# Altium schematic sheet BMS_TopLevel.SchDoc: TopLevel schematic
size A3; SheetNumber: 1; SheetTotal: 7
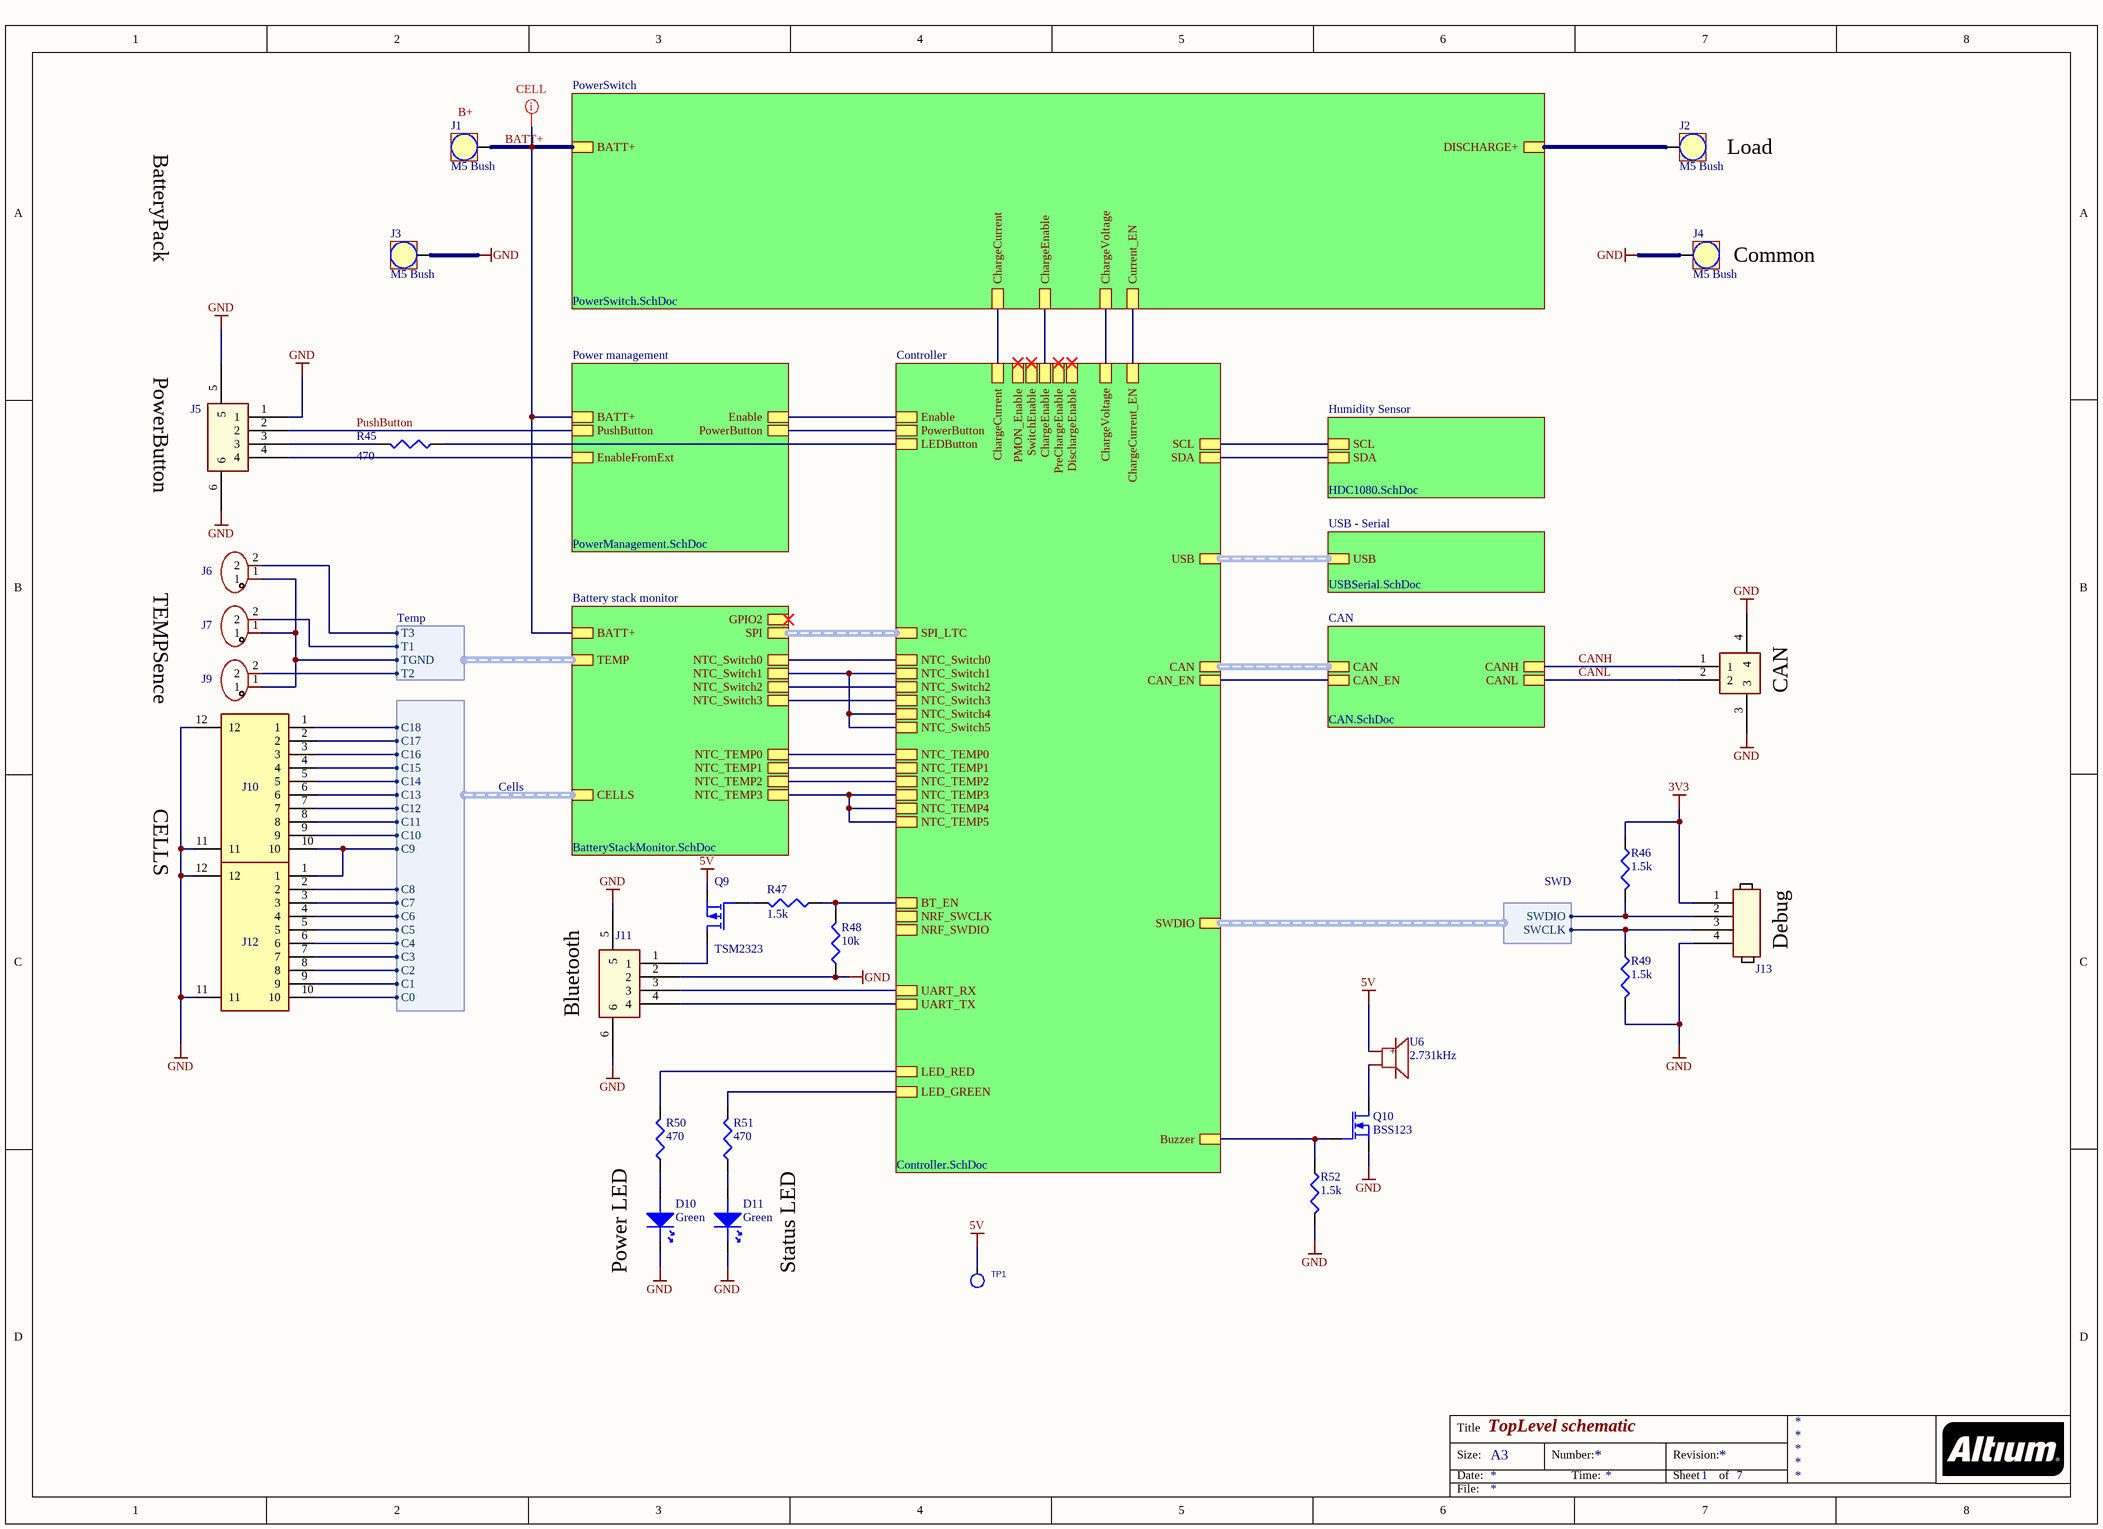
[diagram p0: BMS_TopLevel.SchDoc]

## Parts
D10  Green  [LED0603]
D11  Green  [LED0603]
J1  M5 Bush  [CONN-TH_T44001]
J2  M5 Bush  [CONN-TH_T44001]
J3  M5 Bush  [CONN-TH_T44001]
J4  M5 Bush  [CONN-TH_T44001]
J5  1.25-4PWTDK  [SM04B-GHS-TB]  (value not drawn)
J6  WAFER-XH254Z-2A  [CONN-TH_2P-P2.50_XH-2AW]  (value not drawn)
J7  WAFER-XH254Z-2A  [CONN-TH_2P-P2.50_XH-2AW]  (value not drawn)
J8  1.25-2PWTDK  [BM02B-GHS-TBT_1]  (value not drawn)
J9  WAFER-XH254Z-2A  [CONN-TH_2P-P2.50_XH-2AW]  (value not drawn)
J10  S10B-PH-SM4-TB_LF__SN_  [S10B-PH-SM4-TB]  (value not drawn)
J11  1.25-4PWTDK  [SM04B-GHS-TB]  (value not drawn)
J12  S10B-PH-SM4-TB_LF__SN_  [S10B-PH-SM4-TB]  (value not drawn)
J13  4 HEADER  [PZ-4P-2_54]  (value not drawn)
Q9  TSM2323  [SOT-23]
Q10  BSS123  [SOT-23]
R45  470  [0402]
R46  1.5k  [0402]
R47  1.5k  [0402]
R48  10k  [0402]
R49  1.5k  [0402]
R50  470  [0402]
R51  470  [0402]
R52  1.5k  [0402]
TP1  1.3TP  [TP2-1.3MM]  (value not drawn)  (no BOM)
U6  2.731kHz  [BUZ-SMD_4P-L7.5-W7.5-BR]

## Sub-sheets
Battery stack monitor = BatteryStackMonitor.SchDoc: SPI (harness SPI), CELLS (harness Cells), TEMP (harness Temp), BATT+, NTC_Switch0, NTC_Switch1, NTC_Switch2, NTC_Switch3, NTC_TEMP2, NTC_TEMP3, NTC_TEMP0, NTC_TEMP1, GPIO2
CAN = CAN.SchDoc: CANH, CAN (harness CAN), CANL, CAN_EN
Controller = Controller.SchDoc: SPI_LTC (harness SPI), DischargeEnable, ChargeEnable, SwitchEnable, PreChargeEnable, CAN (harness CAN), SWDIO (harness SWD), Buzzer, PMON_Enable, CAN_EN, ChargeCurrent, ChargeVoltage, NTC_Switch0, NTC_Switch1, NTC_Switch2, NTC_Switch3, NTC_Switch4, NTC_Switch5, NTC_TEMP0, NTC_TEMP1, NTC_TEMP2, NTC_TEMP3, NTC_TEMP4, NTC_TEMP5, ChargeCurrent_EN, USB (harness USB), LED_RED, LED_GREEN, UART_TX, UART_RX, NRF_SWCLK, NRF_SWDIO, Enable, PowerButton, LEDButton, SCL, SDA, BT_EN
Humidity Sensor = HDC1080.SchDoc: SCL, SDA
Power management = PowerManagement.SchDoc: PushButton, BATT+, Enable, PowerButton, EnableFromExt
PowerSwitch = PowerSwitch.SchDoc: ChargeEnable, DISCHARGE+, BATT+, ChargeCurrent, ChargeVoltage, Current_EN
USB - Serial = USBSerial.SchDoc: USB (harness USB)

## Harnesses
Cells: C1, C9, C2, C3, C4, C5, C6, C7, C8, C10, C11, C0, C12, C13, C14, C15, C16, C17, C18
Temp: T1, T2, TGND, T3
SWD: SWCLK, SWDIO

## Nets
3V3: J13.1 R46.1
5V: Q9.S TP1.1(TP) U6.1(+)
GND: D10.1 D11.1 J3.1 J4.1 J5.1 J5.5 J5.6 J8.3 J8.4 J10.11 J10.12 J11.2 J11.5 J11.6 J12.11 J12.12 J13.4 Q10.S R48.1 R49.2 R52.2
BATT+: J1.1 ; sheet Battery stack monitor/BATT+, sheet PowerSwitch/BATT+, sheet Power management/BATT+
CANH: J8.1 ; sheet CAN/CANH
CANL: J8.2 ; sheet CAN/CANL
PushButton: J5.2 ; sheet Power management/PushButton
NetD10_2: D10.2 R50.1
NetD11_2: D11.2 R51.1
NetJ2_1: J2.1 ; sheet PowerSwitch/DISCHARGE+
NetJ5_3: J5.3 R45.2
NetJ5_4: J5.4 ; sheet Power management/EnableFromExt
NetJ6_1: J6.1 J7.1 J9.1 ; sheet Battery stack monitor/TEMP.TGND
NetJ6_2: J6.2 ; sheet Battery stack monitor/TEMP.T3
NetJ7_2: J7.2 ; sheet Battery stack monitor/TEMP.T1
NetJ9_2: J9.2 ; sheet Battery stack monitor/TEMP.T2
NetJ10_1: J10.1 ; sheet Battery stack monitor/CELLS.C18
NetJ10_2: J10.2 ; sheet Battery stack monitor/CELLS.C17
NetJ10_3: J10.3 ; sheet Battery stack monitor/CELLS.C16
NetJ10_4: J10.4 ; sheet Battery stack monitor/CELLS.C15
NetJ10_5: J10.5 ; sheet Battery stack monitor/CELLS.C14
NetJ10_6: J10.6 ; sheet Battery stack monitor/CELLS.C13
NetJ10_7: J10.7 ; sheet Battery stack monitor/CELLS.C12
NetJ10_8: J10.8 ; sheet Battery stack monitor/CELLS.C11
NetJ10_9: J10.9 ; sheet Battery stack monitor/CELLS.C10
NetJ10_10: J10.10 J12.1 ; sheet Battery stack monitor/CELLS.C9
NetJ11_1: J11.1 Q9.D
NetJ11_3: J11.3 ; sheet Controller/UART_RX
NetJ11_4: J11.4 ; sheet Controller/UART_TX
NetJ12_2: J12.2 ; sheet Battery stack monitor/CELLS.C8
NetJ12_3: J12.3 ; sheet Battery stack monitor/CELLS.C7
NetJ12_4: J12.4 ; sheet Battery stack monitor/CELLS.C6
NetJ12_5: J12.5 ; sheet Battery stack monitor/CELLS.C5
NetJ12_6: J12.6 ; sheet Battery stack monitor/CELLS.C4
NetJ12_7: J12.7 ; sheet Battery stack monitor/CELLS.C3
NetJ12_8: J12.8 ; sheet Battery stack monitor/CELLS.C2
NetJ12_9: J12.9 ; sheet Battery stack monitor/CELLS.C1
NetJ12_10: J12.10 ; sheet Battery stack monitor/CELLS.C0
NetJ13_2: J13.2 R46.2 ; sheet Controller/SWDIO.SWDIO
NetJ13_3: J13.3 R49.1 ; sheet Controller/SWDIO.SWCLK
NetQ9_G: Q9.G R47.2
NetQ10_D: Q10.D U6.2
NetQ10_G: Q10.G R52.1 ; sheet Controller/Buzzer
NetR45_1: R45.1 ; sheet Controller/LEDButton
NetR47_1: R47.1 R48.2 ; sheet Controller/BT_EN
NetR50_2: R50.2 ; sheet Controller/LED_RED
NetR51_2: R51.2 ; sheet Controller/LED_GREEN
(unnamed): sheet Battery stack monitor/NTC_Switch0, sheet Controller/NTC_Switch0
(unnamed): sheet Battery stack monitor/NTC_Switch1, sheet Controller/NTC_Switch1, sheet Controller/NTC_Switch4, sheet Controller/NTC_Switch5
(unnamed): sheet Battery stack monitor/NTC_Switch2, sheet Controller/NTC_Switch2
(unnamed): sheet Battery stack monitor/NTC_Switch3, sheet Controller/NTC_Switch3
(unnamed): sheet Battery stack monitor/NTC_TEMP2, sheet Controller/NTC_TEMP2
(unnamed): sheet Battery stack monitor/NTC_TEMP3, sheet Controller/NTC_TEMP3, sheet Controller/NTC_TEMP4, sheet Controller/NTC_TEMP5
(unnamed): sheet Battery stack monitor/NTC_TEMP0, sheet Controller/NTC_TEMP0
(unnamed): sheet Battery stack monitor/NTC_TEMP1, sheet Controller/NTC_TEMP1
(unnamed): sheet Controller/ChargeEnable, sheet PowerSwitch/ChargeEnable
(unnamed): sheet Controller/CAN_EN, sheet CAN/CAN_EN
(unnamed): sheet Controller/ChargeCurrent, sheet PowerSwitch/ChargeCurrent
(unnamed): sheet Controller/ChargeVoltage, sheet PowerSwitch/ChargeVoltage
(unnamed): sheet Controller/ChargeCurrent_EN, sheet PowerSwitch/Current_EN
(unnamed): sheet Controller/Enable, sheet Power management/Enable
(unnamed): sheet Controller/PowerButton, sheet Power management/PowerButton
(unnamed): sheet Controller/SCL, sheet Humidity Sensor/SCL
(unnamed): sheet Controller/SDA, sheet Humidity Sensor/SDA

Not connected (* = marked no-connect by the designer): U6 3 4

## Buses and harness runs
harness sheet Battery stack monitor/SPI = sheet Controller/SPI_LTC
harness sheet CAN/CAN = sheet Controller/CAN
harness sheet Controller/USB = sheet USB - Serial/USB

## Layout directives
net class CELL: BATT+

## Notes on the sheet
- BatteryPack
- (near J2) Load
- (near J4) Common
- (near J5) PowerButton
- TEMPSence
- (near J8) CAN
- CELLS
- (near J11) Bluetooth
- (near J13) Debug
- Power LED
- Status LED
- Labels drawn without touching a wire or pin: B+
- Title
- Size:
- Date:
- A3
- Number:
- Time:
- Revision:
- Sheet
- of
- File:

## Library data of the parts
D10 D11 = KP-2012SGC: Led, Green, Li:12mcd, Vf:2.2V, If:0.02A; Brand: KingBright; Case Style: 0805; Forward Current: 0.02A; Forward Voltage: 2.2V; Luminous Intensity: 12mcd; Brand Number: KP-2012SGC; Order Code Supplier: 1318243; Price: 0,06; Supplier: Farnell; Temperature Range: -30°C to +85°C
J1-J4 = T44001: Bush with Circumference M4; Brand: Wurth; Brand Number: 7460408; Case Style: M5Bush; Order Code Supplier: 1821279; Price: 4,17; Supplier: Farnell
J6 J7 J9 = WAFER-XH254Z-2A: Manufacturer: HANBO(汉博); Add into BOM: yes; Pins Structure: 1x2P; Pitch: 2.54mm; Reference Series: XH; Number of PINs Per Row: 2; Current Rating (Max): 3A; Symbol: WAFER-XH254Z-2A; Device: WAFER-XH254Z-2A; LCSC Part Name: WAFER-XH254Z-2A; Supplier Part: C7432682; Manufacturer Part: WAFER-XH254Z-2A; Supplier Footprint: 插件,P=2.5mm; Datasheet: https://atta.szlcsc.com/upload/public/pdf/source/20230718/3B4FABA5D38EFB02DAF74E7C2B33D98F.pdf; Supplier: LCSC; Convert to PCB: yes; Mounting Style: 直插; Number of Pins: 2P; Number of Rows: 1; Operating Temperature Range: -25℃~+85℃
J10 J12 = S10B-PH-SM4-TB_LF__SN_: Connector; Manufacturer_Name: JST (JAPAN SOLDERLESS TERMINALS); Manufacturer_Part_Number: S10B-PH-SM4-TB(LF)(SN); Datasheet Link: http://uk.rs-online.com/web/p/products/6881350; Mouser Part Number: 306-S10BPHSM4TBLFSN; Mouser Price/Stock: https://www.mouser.co.uk/ProductDetail/JST-Commercial/S10B-PH-SM4-TBLFSN?qs=QpmGXVUTftH7ZRPAPdrNVw%3D%3D; Arrow Part Number: S10B-PH-SM4-TB(LF)(SN); Arrow Price/Stock: https://www.arrow.com/en/products/s10b-ph-sm4-tb-lf-sn/jst-manufacturing?region=nac
Q9 = TSM2323: Mosfet, P-channel, Vds:20V, Id:4.7A, Vgs-th:1V, Rds-on:0.039ohm; Brand: Taiwan Semiconductor; Brand Number: TSM2323CX; Drain Current: 4.7A; Drain Source Voltage: 20V; Gate Source Voltage: 8V; Threshold Voltage: 1V; Case Style: SOT-23; On Resistance: 0.039ohm; Order Code Supplier: 1864590; Price: 0,195; Supplier: Farnell; Temperature Range: -55°C to +150°C; Transistor Polarity: P-channel
Q10 = BSS123: Mosfet, N-channel, Vds:100V, Id:0.15A, Vgs-th:2.8V, Rds-on:3.5ohm; Brand: NXP; Drain Current: 0.15A; Drain Source Voltage: 100V; Gate Source Voltage: 20V; On Resistance: 3.5ohm; Threshold Voltage: 2.8V; Brand Number: BSS123; Case Style: SOT-23; Order Code Supplier: 1510764; Price: 0,082; Supplier: Farnell; Temperature Range: -55°C to +150°C; Transistor Polarity: N-channel
R45 R50 R51 = 470/0402/0063W/50V: Resistor, 470, 1%, 0.0625W, 50V, 100PPM, 0402; Brand: VISHAY DRALORIC; Brand Number: CRG0402F470R; Power Rating: 0.063W; Case Style: 0402; Order Code Supplier: 2331533; Price: 0,0099; Resistance: 470; Supplier: Farnell; Temperature Coefficient: ± 100PPM; Temperature Range: -55°C to +125°C; Voltage Rating: 50V
R46-R49 R52 = 1.5k/0402/0063W/50V: Resistor, 1.5k, 0.1%, 0.0625W, 50V, 100PPM, 0402; Brand: VISHAY DRALORIC; Brand Number: CRCW04021K50FKED; Power Rating: 0.063W; Case Style: 0402; Order Code Supplier: 2121624; Price: 0,0054; Resistance: 1.5k; Supplier: Farnell; Temperature Coefficient: ± 100PPM; Temperature Range: -55°C to +125°C; Voltage Rating: 50V
TP1 = TESTPT4: 1.3mm
U6 = HYG-7525A: Manufacturer: HYDZ(华宇); Add into BOM: yes; Current Consumption: 90mA; Sound Pressure Level(SPL): 85dB; Symbol: HYG-7525A; Device: HYG-7525A; LCSC Part Name: 贴片无源蜂鸣器; Supplier Part: C7544812; Manufacturer Part: HYG-7525A; Supplier Footprint: SMD,7.5x7.5mm; JLCPCB Part Class: 扩展库; Datasheet: https://atta.szlcsc.com/upload/public/pdf/source/20230825/78098EC44B170663F3151CF5366FAD5D.pdf; Supplier: LCSC; Convert to PCB: yes; Value: 2.731kHz